# EAGLE schematic megatari_punk_console_v1-0 (EAGLE 5.10)
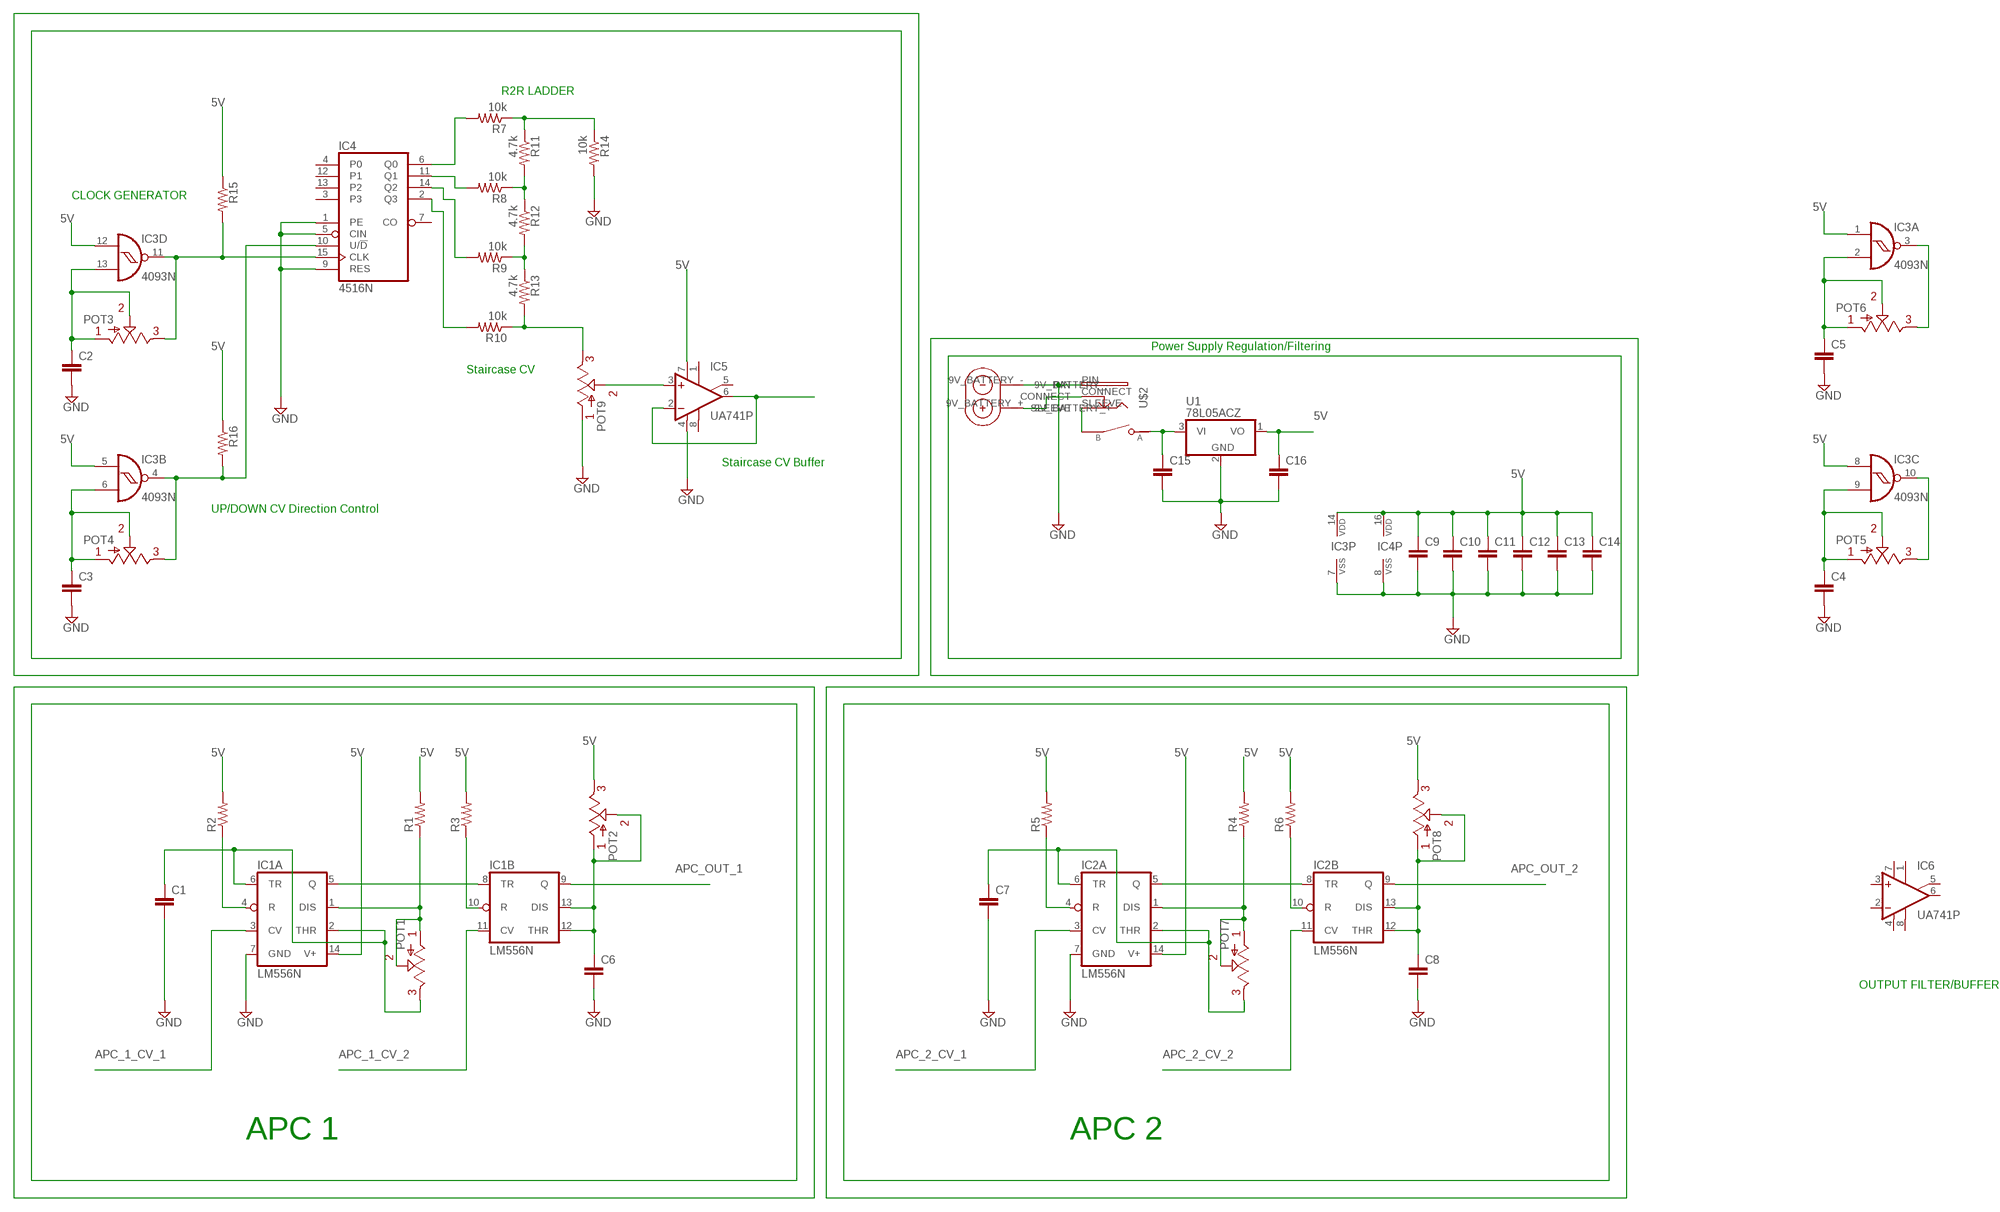
[diagram p0: schematic, sheet 1]

## Parts
C1  C5/3  [C5B3]
C2  C5/3  [C5B3]
C3  C5/3  [C5B3]
C4  C5/3  [C5B3]
C5  C5/3  [C5B3]
C6  C5/3  [C5B3]
C7  C5/3  [C5B3]
C8  C5/3  [C5B3]
C9  C5/3  [C5B3]
C10  C5/3  [C5B3]
C11  C5/3  [C5B3]
C12  C5/3  [C5B3]
C13  C5/3  [C5B3]
C14  C5/3  [C5B3]
C15  C5/3  [C5B3]
C16  C5/3  [C5B3]
IC1  LM556N  [DIL14]
IC2  LM556N  [DIL14]
IC3  4093N  [DIL14]
IC4  4516N  [DIL16]
IC5  UA741P  [DIL08]
IC6  UA741P  [DIL08]
POT1  POT  [POT]
POT2  POT  [POT]
POT3  POT  [POT]
POT4  POT  [POT]
POT5  POT  [POT]
POT6  POT  [POT]
POT7  POT  [POT]
POT8  POT  [POT]
POT9  POT  [POT]
R1  RESISTOR  [RESISTOR]
R2  RESISTOR  [RESISTOR]
R3  RESISTOR  [RESISTOR]
R4  RESISTOR  [RESISTOR]
R5  RESISTOR  [RESISTOR]
R6  RESISTOR  [RESISTOR]
R7  10k  RESISTOR  [RESISTOR]
R8  10k  RESISTOR  [RESISTOR]
R9  10k  RESISTOR  [RESISTOR]
R10  10k  RESISTOR  [RESISTOR]
R11  4.7k  RESISTOR  [RESISTOR]
R12  4.7k  RESISTOR  [RESISTOR]
R13  4.7k  RESISTOR  [RESISTOR]
R14  10k  RESISTOR  [RESISTOR]
R15  RESISTOR  [RESISTOR]
R16  RESISTOR  [RESISTOR]
SW1  SPST_SWITCH  [SPST_TOGGLE_SWITCH]
U1  78L05ACZ  [TO-92]
U$1  9V_BATTERY_CLIP  [9V_BATTERY]
U$2  DC_JACK_OFFBOARD  [DC_JACK_OFFBOARD]

## Nets
5V: C9.1 C10.1 C11.1 C12.1 C13.1 C14.1 C16.1 IC1.14(A:V+) IC2.14(A:V+) IC3.1(A:I0) IC3.5(B:I0) IC3.8(C:I0) IC3.12(D:I0) IC3.14(P:VDD) IC4.16(VDD) IC5.7(V+) POT2.3 POT8.3 R1.2 R2.2 R3.2 R4.2 R5.2 R6.2 R15.1 R16.1 U1.1(VO)
APC_1_CV_1: IC1.3(A:CV)
APC_1_CV_2: IC1.11(B:CV)
APC_2_CV_1: IC2.3(A:CV)
APC_2_CV_2: IC2.11(B:CV)
APC_OUT_1: IC1.9(B:Q)
APC_OUT_2: IC2.9(B:Q)
GND: C1.2 C2.2 C3.2 C4.2 C5.2 C6.2 C7.2 C8.2 C9.2 C10.2 C11.2 C12.2 C13.2 C14.2 C15.2 C16.2 IC1.7(A:GND) IC2.7(A:GND) IC3.7(P:VSS) IC4.1(PE) IC4.5(CIN) IC4.8(VSS) IC4.9(RES) IC5.4(V-) POT9.1 R14.2 U1.2(GND) U$1.9V_BATTERY_- U$2.PIN
N$1: IC1.5(A:Q) IC1.8(B:TR)
N$2: C1.1 IC1.2(A:THR) IC1.6(A:TR) POT1.3
N$3: IC1.1(A:DIS) POT1.1 POT1.2 R1.1
N$4: IC1.4(A:R) R2.1
N$5: IC3.11(D:O) IC4.15(CLK) POT3.3 R15.2
N$6: C2.1 IC3.13(D:I1) POT3.1 POT3.2
N$7: IC1.10(B:R) R3.1
N$8: IC3.4(B:O) IC4.10(U/!D) POT4.3 R16.2
N$9: C6.1 IC1.12(B:THR) IC1.13(B:DIS) POT2.1 POT2.2
N$10: C3.1 IC3.6(B:I1) POT4.1 POT4.2
N$11: IC3.10(C:O) POT5.3
N$12: C4.1 IC3.9(C:I1) POT5.1 POT5.2
N$13: IC3.3(A:O) POT6.3
N$14: C5.1 IC3.2(A:I1) POT6.1 POT6.2
N$15: IC2.5(A:Q) IC2.8(B:TR)
N$16: IC2.1(A:DIS) POT7.1 POT7.2 R4.1
N$17: C7.1 IC2.2(A:THR) IC2.6(A:TR) POT7.3
N$18: IC2.4(A:R) R5.1
N$19: IC2.10(B:R) R6.1
N$20: C8.1 IC2.12(B:THR) IC2.13(B:DIS) POT8.1 POT8.2
N$21: POT9.3 R10.1 R13.2
N$22: R9.1 R12.2 R13.1
N$23: R8.1 R11.2 R12.1
N$24: R7.1 R11.1 R14.1
N$25: IC4.6(Q0) R7.2
N$26: IC4.11(Q1) R8.2
N$27: IC4.14(Q2) R9.2
N$28: IC4.2(Q3) R10.2
N$29: IC5.3(+IN) POT9.2
N$30: IC5.2(-IN) IC5.6(OUT)
N$31: U$1.9V_BATTERY_+ U$2.CONNECT
N$33: SW1.B U$2.SLEEVE
N$34: C15.1 SW1.A U1.3(VI)
Unconnected: IC4.3 IC4.4(P0) IC4.7(CO) IC4.12(P1) IC4.13(P2) IC5.1(ON1) IC5.5(ON2) IC5.8(OPT) IC6.1(ON1) IC6.2(-IN) IC6.3(+IN) IC6.5(ON2) IC6.6(OUT) IC6.8(OPT)

## Notes on the sheet
- R2R LADDER
- CLOCK GENERATOR
- Power Supply Regulation/Filtering
- Staircase CV
- Staircase CV Buffer
- UP/DOWN CV Direction Control
- OUTPUT FILTER/BUFFER
- APC 1 | APC 2

## Power pins joined to a net without a drawn wire
V+: IC6.7(V+)
V-: IC6.4(V-)

## Library data of the parts
C1-C16 = capacitor-wima:C: CAPACITOR naming: grid - package width
IC1 IC2 = linear:*556: Dual TIMER
IC3 = 40xx:4093: Quad 2-input NAND schmitt trigger
IC4 = 45xx:4516: Binary up down COUNTER
IC5 IC6 = linear:*741: OP AMP
POT1-POT9 = 00_steve:POT
R1-R16 = 00_steve:RESISTOR
SW1 = 00_steve:SPST_SWITCH: SPST Switch Part No.: M101 Source: (http://www.led-switch.com)
U1 = 00_steve:78L05ACZ
U$1 = 00_steve:9V_BATTERY_CLIP
U$2 = 00_steve:DC_JACK_OFFBOARD